# Altium schematic sheet schematic.SchDoc: <Project Name>
size A4; ENG_APP_DATE: --/--/--; DSN_APP_DATE: --/--/--; CHK_APP_DATE: --/--/--; Engineer: Engineer; Address4: Thành phố Hồ Chí Minh; DocumentNumber: 1; Revision: 1.0; SheetNumber: 1; SheetTotal: 1
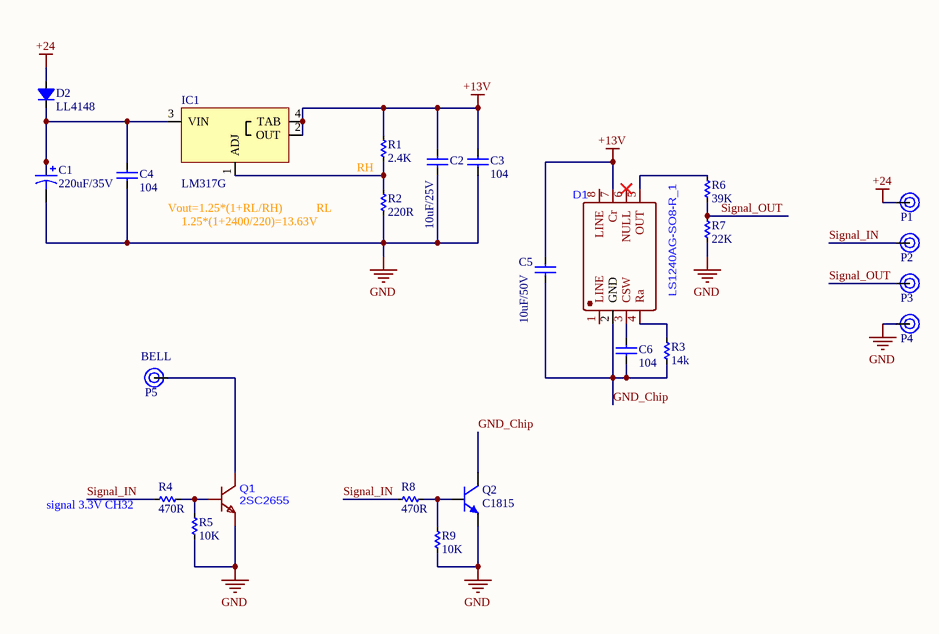
[diagram p0: schematic.SchDoc]

## Parts
C1  220uF/35V  [C8X12mm]
C2  10uF/25V  [C_0805_SMD]
C3  104  [C_0805_SMD]
C4  104  [C_0805_SMD]
C5  10uF/50V  [C_0805_SMD]
C6  104  [C_0805_SMD]
D1  LS1240AG-SO8-R_1  [LS1240AG-SO8-R]
D2  LL4148  [SOD80C_MFG]
IC1  LM317G  [SOT223-4N]
P1  Pad 1.5mm  [Pad 1.5mm 3mm]  (value not drawn)  (no BOM)
P2  Pad 1.5mm  [Pad 1.5mm 3mm]  (value not drawn)  (no BOM)
P3  Pad 1.5mm  [Pad 1.5mm 3mm]  (value not drawn)  (no BOM)
P4  Pad 1.5mm  [Pad 1.5mm 3mm]  (value not drawn)  (no BOM)
P5  Pad 1.5mm  [Pad 1.5mm 3mm]  (value not drawn)  (no BOM)
Q1  2SC2655  [2SC2655]
Q2  C1815  [SOT23_N NXP]
R1  2.4K  [RES-SMD-0805]
R2  220R  [RES-SMD-0805]
R3  14k  [RES-SMD-0805]
R4  470R  [RES-SMD-0805]
R5  10K  [RES-SMD-0805]
R6  39K  [RES-SMD-0805]
R7  22K  [RES-SMD-0805]
R8  470R  [RES-SMD-0805]
R9  10K  [RES-SMD-0805]

## Nets
+13V: C2.2 C3.2 C5.2 D1.7(Cr) IC1.2(OUT) IC1.4(TAB) R1.1
+24: D2.2 P1.1
GND: C1.2 C2.1 C3.1 C4.1 P4.1 Q1.1(E) Q2.2(E) R2.2 R5.2 R7.2 R9.2
GND_Chip: C5.1 C6.1 D1.2(GND) Q2.3(C) R3.2
Signal_IN: P2.1 R4.2 R8.2
Signal_OUT: P3.1 R6.2 R7.1
NetC1_1: C1.1 C4.2 D2.1 IC1.3(VIN)
NetC6_2: C6.2 D1.3(CSW)
NetD1_4: D1.4(Ra) R3.1
NetD1_5: D1.5(OUT) R6.1
NetIC1_1: IC1.1(ADJ) R1.2 R2.1
NetP5_1: P5.1 Q1.2(C)
NetQ1_3: Q1.3(B) R4.1 R5.1
NetQ2_1: Q2.1(B) R8.1 R9.1

Not connected (* = marked no-connect by the designer): D1 1(LINE) 6(NULL)* 8(LINE)

## Notes on the sheet
- Vout=1.25*(1+RL/RH)
- 1.25*(1+2400/220)=13.63V
- RL
- RH
- (near P5) BELL
- (near R4) signal 3.3V CH32
- Title
- Size:
- Date:
- A4
- Number:
- Time:
- Revision:
- Sheet
- of
- File:

## Library data of the parts
C1 = Cap Pol 220uF/35V: Polarized Capacitor (Axial) 220uF 35V; Code: 1402-228
C2 = Cap 0805 10uF 25V: Cap SMD 0805 10uF; Code: 1436-100
C3 C4 C6 = Cap 0805 104 100nF: Cap SMD 0805 104-100nF-0.1uF 50V; Code: 1438-080
C5 = Cap 0805 10uF 50V: Cap SMD 0805 10uF 50V; Code: 1438-100
D2 = LL4148: 0.2A, 100V, SOD80; Code: 2001-012; Designed by: Nhox
IC1 = LM317G: HIGH CURRENT 1.3V TO 37V ADJUSTABLE VOLTAGE REGULATOR; Designed by: TranLuyen; Code: N/A
P1-P5 = Pad 1.5mm 3mm
Q2 = C1815 SMD SOT-23: NPN SMD Transistor SOT23; Code: 1701-077
R1 = Res 2.4k 0805: Resistor SMD 0805; Code: 1025-201
R2 = Res 220R 0805: Resistor SMD 0805; Code: 1025-071
R3 = Res 13K 0805: Resistor SMD 0805, 14k Ohm; Code: 1025-361
R4 R8 = Res 470R 0805: Resistor SMD 0805; Code: 1024-078; Value: 470R
R5 R9 = Res 10k 0805: Resistor SMD 0805; Code: 1024-111
R6 = Res 39K 0805: Resistor SMD 0805; Code: 1024-126
R7 = Res 22K 0805: Resistor SMD 0805; Code: 1024-120